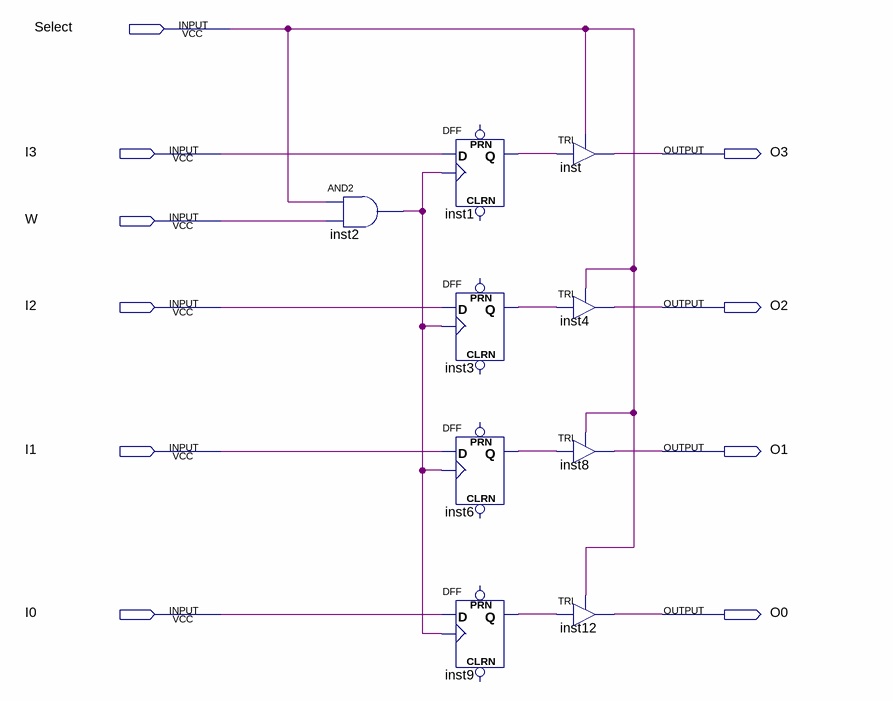
[diagram p0: schematic sheet]
// Quartus schematic MC.bdf as structural Verilog: 9 symbols, 10 pins
module MC (
  input  Select,
  input  I3,
  input  W,
  input  I2,
  input  I1,
  input  I0,
  output O3,
  output O2,
  output O1,
  output O0
);

  wire inst1_q, inst2_out, inst3_q, inst6_q, inst9_q;

  and inst2 (inst2_out, Select, W);
  DFF inst1 (.CLK(inst2_out), .D(I3), .Q(inst1_q));  // open: CLRN, PRN
  DFF inst3 (.CLK(inst2_out), .D(I2), .Q(inst3_q));  // open: CLRN, PRN
  DFF inst6 (.CLK(inst2_out), .D(I1), .Q(inst6_q));  // open: CLRN, PRN
  DFF inst9 (.CLK(inst2_out), .D(I0), .Q(inst9_q));  // open: CLRN, PRN
  TRI inst (.IN(inst1_q), .OE(Select), .OUT(O3));
  TRI inst4 (.IN(inst3_q), .OE(Select), .OUT(O2));
  TRI inst8 (.IN(inst6_q), .OE(Select), .OUT(O1));
  TRI inst12 (.IN(inst9_q), .OE(Select), .OUT(O0));
endmodule
